# Altium project OpticalSensor.PrjPcb
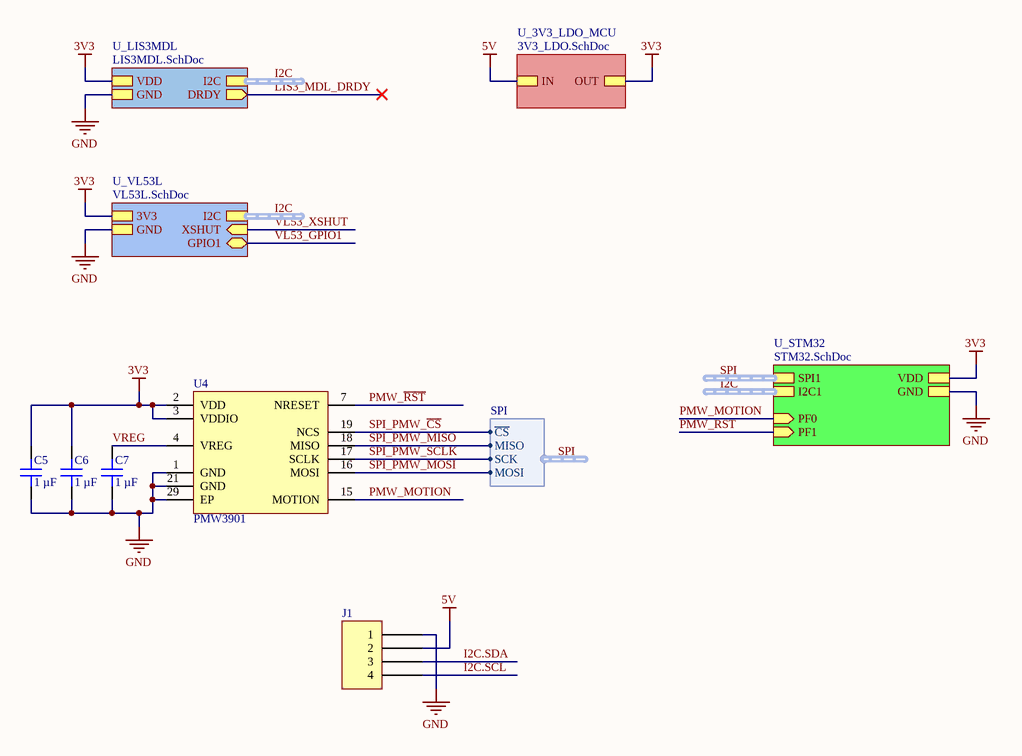
[diagram p0: OpticalSensor.SchDoc]
3 sheets, 19 parts. Net scope: hierarchical (ports join the sheet entries above them; power ports are global).
Board file: OpticalSensor.PcbDoc
Sheets:
  OpticalSensor.SchDoc
    U_3V3_LDO_MCU = 3V3_LDO.SchDoc
    U_STM32 = STM32.SchDoc

## Sheet OpticalSensor.SchDoc
size A; SheetNumber: 1; SheetTotal: 5

### Parts
C5  1 µF  [CAP 0402_1005]
C6  1 µF  [CAP 0402_1005]
C7  1 µF  [CAP 0402_1005]
J1  SM04B-SRSS-TB(LF)(SN)  [JST SM04B-SRSS-TB]  (value not drawn)
U4  PMW3901  [PMW3901]

### Sub-sheets
U_3V3_LDO_MCU = 3V3_LDO.SchDoc: OUT, IN
U_LIS3MDL = LIS3MDL.SchDoc (file not in this document): VDD, GND, I2C (harness I2C), DRDY (out)
U_STM32 = STM32.SchDoc: VDD, GND, SPI1 (harness SPI), I2C1 (harness I2C), PF0 (in), PF1 (in)
U_VL53L = VL53L.SchDoc (file not in this document): 3V3, GND, XSHUT (in), GPIO1 (bidir), I2C (harness I2C)

### Harnesses
SPI: MOSI, MISO, SCK, ~{CS}

### Nets
3V3: C5.2 C6.2 U4.2(VDD) U4.3(VDDIO) ; sheet U_3V3_LDO_MCU/OUT, sheet U_LIS3MDL/VDD, sheet U_STM32/VDD, sheet U_VL53L/3V3
5V: J1.2 ; sheet U_3V3_LDO_MCU/IN
GND: C5.1 C6.1 C7.1 J1.1 U4.1(GND) U4.21(GND) U4.29(EP) ; sheet U_LIS3MDL/GND, sheet U_STM32/GND, sheet U_VL53L/GND
I2C.SCL: J1.4
I2C.SDA: J1.3
LIS3_MDL_DRDY: sheet U_LIS3MDL/DRDY
PMW_MOTION: U4.15(MOTION) ; sheet U_STM32/PF0
PMW_~{RST}: U4.7(NRESET) ; sheet U_STM32/PF1
SPI_PMW_~{CS}: U4.19(NCS) ; sheet U_STM32/SPI1.~{CS}  [project net SPI.~{CS}]
SPI_PMW_MISO: U4.18(MISO) ; sheet U_STM32/SPI1.MISO  [project net SPI.MISO]
SPI_PMW_MOSI: U4.16(MOSI) ; sheet U_STM32/SPI1.MOSI  [project net SPI.MOSI]
SPI_PMW_SCLK: U4.17(SCLK) ; sheet U_STM32/SPI1.SCK  [project net SPI.SCK]
VL53_GPIO1: sheet U_VL53L/GPIO1
VL53_XSHUT: sheet U_VL53L/XSHUT
VREG: C7.2 U4.4(VREG)

### Buses and harness runs
harness I2C = sheet U_LIS3MDL/I2C
harness I2C = sheet U_STM32/I2C1
harness I2C = sheet U_VL53L/I2C
harness SPI = sheet U_STM32/SPI1

### Library data of the parts
C5-C7 = C0402C104K4RACAUTO: CAP CER 0.1UF 16V X7R 0402; manufacturer: KEMET; Capacitance: 0.1 µF; Tolerance: ±10%; Part Number: C0402C104K4RACAUTO; Value: 1 µF; Applications: Automotive, Bypass, Decoupling; componentlink1description: Datasheet; componentlink1url: https://api.kemet.com/component-edge/download/specsheet/C0402C104K4RACAUTO.pdf; componentlink2description: DigiKey Link; componentlink2url: https://www.digikey.com/en/products/detail/kemet/C0402C104K4RACAUTO/3314827; Device Package: 0402 (1005 Metric); lastupdated: 8/14/2022 9:05:51 PM; Lifecycle Status: Active; Minimum Order: 1; Mounting Type: Surface Mount, MLCC; Operating Temperature: -55°C ~ 125°C; Package / Case: 0402 (1005 Metric); packaging: TapeAndReel; partid: 3024; Part Status: Active; price: 0.01; Ratings: AEC-Q200; series: SMD Auto X7R; Size / Dimension: 0.039" L x 0.020" W (1.00mm x 0.50mm); Supplier 1: DigiKey; Supplier Part Number 1: 399-6828-1-ND; Temperature Coefficient: X7R; Thickness (Max): 0.022" (0.55mm); Voltage - Rated: 16V
J1 = SM04B-SRSS-TB(LF)(SN): CONN HEADER SMD R/A 4POS 1MM; Manufacturer: JST Sales America Inc.; Current Rating (Amps): 0.7A; Material Flammability Rating: UL94 V-0; Number of Positions: 4; Number of Positions Loaded: All; Pitch - Mating: 0.039" (1.00mm); Shrouding: Shrouded - 4 Wall; Style: Board to Cable/Wire; Voltage Rating: 50V; Part Number: SM04B-SRSS-TB(LF)(SN); ComponentLink1Description: Datasheet; ComponentLink1URL: http://www.jst-mfg.com/product/pdf/eng/eSH.pdf; ComponentLink2Description: DigiKey Link; ComponentLink2URL: http://digikey.com/product-detail/en/jst-sales-america-inc/SM04B-SRSS-TB-LF-SN/455-1804-1-ND/926875; Connector Type: Header; Contact Finish - Mating: Tin; Contact Finish - Post: Tin; Contact Material: Copper Alloy; Contact Shape: Square; Contact Type: Male Pin; Fastening Type: Push-Pull; Features: Solder Retention; Insulation Color: Natural; Insulation Height: 0.114" (2.90mm); Insulation Material: Polyamide (PA), Nylon; LastUpdated: 1/12/2020 11:41:52 PM; Lifecycle Status: Active; Minimum Order: 1; Mounting Type: Surface Mount, Right Angle; Number of Rows: 1; Operating Temperature: -25°C ~ 85°C; Packaging: TapeAndReel; PartId: 62; Part Status: Active; Price: 0.26; Series: SR; Supplier 1: DigiKey; Supplier Part Number 1: 455-1804-1-ND; Termination: Solder
U4 = PMW3901: PMW3901. Optical Flow Sensor

## Sheet 3V3_LDO.SchDoc
size A; SheetNumber: 2; SheetTotal: 5
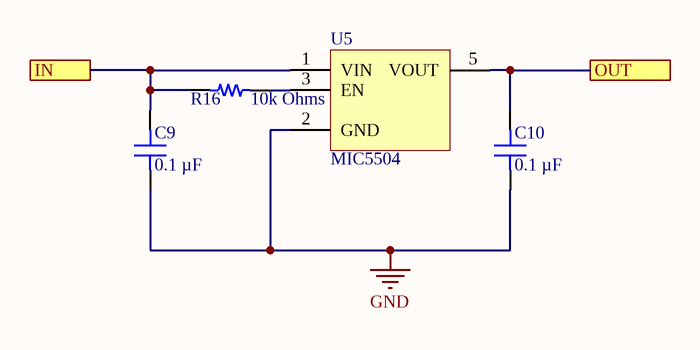
[diagram p1: 3V3_LDO.SchDoc]

### Parts
C9  0.1 µF  [CAP 0402_1005]
C10  0.1 µF  [CAP 0402_1005]
R16  10k Ohms  [RES 0402_1005]
U5  MIC5504  [TI SOT-23-5 DBV]

### Ports
IN, OUT

### Nets
3V3: C10.2 U5.5(VOUT) ; port OUT
5V: C9.2 R16.2 U5.1(VIN) ; port IN
GND: C9.1 C10.1 U5.2(GND)
NetR16_1: R16.1 U5.3(EN)

### Library data of the parts
C9 C10 = C0402C104K4RACAUTO: CAP CER 0.1UF 16V X7R 0402; manufacturer: KEMET; Tolerance: ±10%; Part Number: C0402C104K4RACAUTO; Value: 0.1 µF; Applications: Automotive, Bypass, Decoupling; Capacitance: 0.1 µF; componentlink1description: Datasheet; componentlink1url: https://api.kemet.com/component-edge/download/specsheet/C0402C104K4RACAUTO.pdf; componentlink2description: DigiKey Link; componentlink2url: https://www.digikey.com/en/products/detail/kemet/C0402C104K4RACAUTO/3314827; Device Package: 0402 (1005 Metric); lastupdated: 8/14/2022 9:05:51 PM; Lifecycle Status: Active; Minimum Order: 1; Mounting Type: Surface Mount, MLCC; Operating Temperature: -55°C ~ 125°C; Package / Case: 0402 (1005 Metric); packaging: TapeAndReel; partid: 3024; Part Status: Active; price: 0.01; Ratings: AEC-Q200; series: SMD Auto X7R; Size / Dimension: 0.039" L x 0.020" W (1.00mm x 0.50mm); Supplier 1: DigiKey; Supplier Part Number 1: 399-6828-1-ND; Temperature Coefficient: X7R; Thickness (Max): 0.022" (0.55mm); Voltage - Rated: 16V
R16 = CRCW0402330RJNEDC: RES 330 OHM 5% 1/16W 0402; Manufacturer: Vishay Dale; Power (Watts): 0.063W, 1/16W; Resistance: 330 Ohms; Temperature Coefficient: ±200ppm/°C; Part Number: CRCW0402330RJNEDC; Value: 10k Ohms; ComponentLink1Description: Datasheet; ComponentLink1URL: http://www.vishay.com/docs/28773/crcwce3.pdf; ComponentLink2Description: DigiKey Link; ComponentLink2URL: https://www.digikey.com/en/products/detail/vishay-dale/CRCW0402330RJNEDC/7928545; Composition: Thick Film; Device Package: 0402 (1005 Metric); Height - Seated (Max): 0.014" (0.35mm); LastUpdated: 8/14/2022 9:23:31 PM; Lifecycle Status: Active; Minimum Order: 1; Number of Terminations: 2; Operating Temperature: -55°C ~ 155°C; Package / Case: 0402 (1005 Metric); Packaging: CutTape; PartId: 15989; Part Status: Active; Price: 0.01; Series: CRCW-C; Size / Dimension: 0.039" L x 0.020" W (1.00mm x 0.50mm); Supplier 1: DigiKey; Supplier Part Number 1: 541-4123-1-ND; Supplier Device Package: 0402; Tolerance: ±5%
U5 = MIC5504-3.3YM5: 3.3V LDO

## Sheet STM32.SchDoc
size A; SheetNumber: 4; SheetTotal: 5
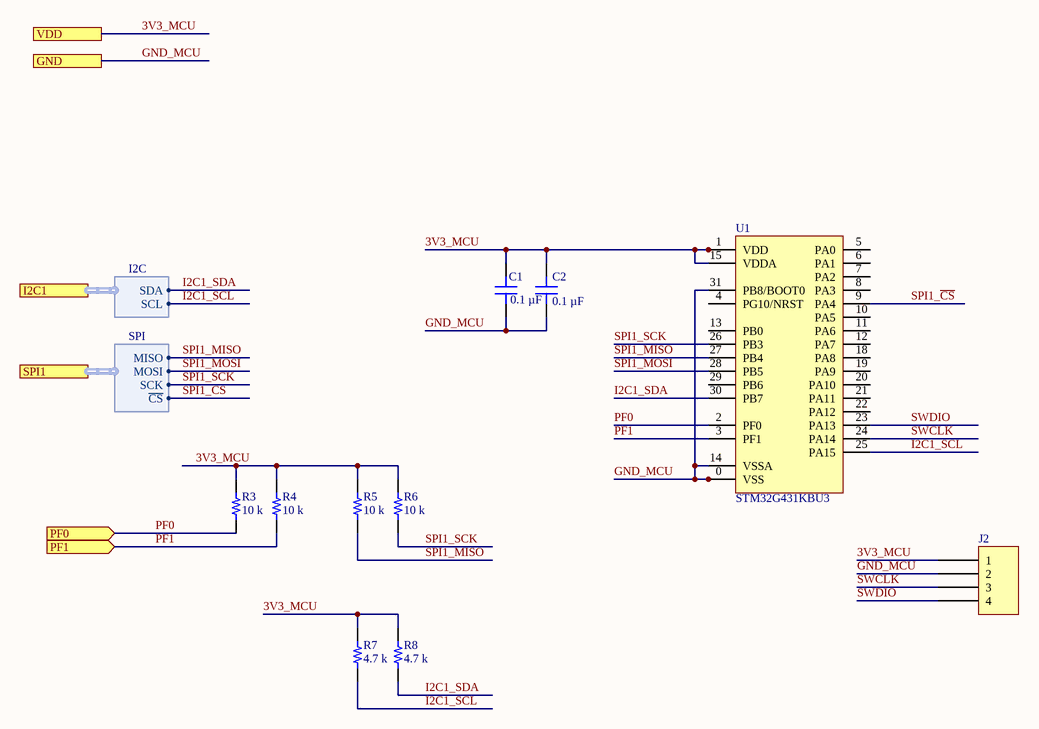
[diagram p2: STM32.SchDoc]

### Parts
C1  0.1 µF  [CAP 0402_1005]
C2  0.1 µF  [CAP 0402_1005]
J2  SM04B-SRSS-TB(LF)(SN)  [JST SM04B-SRSS-TB]  (value not drawn)
R3  10 k  [RES 0402_1005]
R4  10 k  [RES 0402_1005]
R5  10 k  [RES 0402_1005]
R6  10 k  [RES 0402_1005]
R7  4.7 k  [RES 0402_1005]
R8  4.7 k  [RES 0402_1005]
U1  STM32G431KBU3  [QFN50P400X400X60-32N]

### Ports
GND, I2C1 (harness I2C), PF0 (in), PF1 (in), SPI1 (harness SPI), VDD

### Harnesses
I2C: SCL, SDA
SPI: MOSI, MISO, SCK, ~{CS}

### Nets
3V3_MCU: C1.2 C2.2 J2.1 R3.2 R4.2 R5.2 R6.2 R7.2 R8.2 U1.1(VDD) U1.15(VDDA) U1.17(VDD) ; port VDD  [project net 3V3]
GND_MCU: C1.1 C2.1 J2.2 U1.0(VSS) U1.14(VSSA) U1.16(VSS) U1.31(PB8/BOOT0) U1.32(VSS) ; port GND  [project net GND]
I2C1_SCL: R7.1 U1.25(PA15) ; port I2C1.SCL  [project net I2C.SCL]
I2C1_SDA: R8.1 U1.30(PB7) ; port I2C1.SDA  [project net I2C.SDA]
PF0: R3.1 U1.2(PF0) ; port PF0  [project net PMW_MOTION]
PF1: R4.1 U1.3(PF1) ; port PF1  [project net PMW_~{RST}]
SPI1_~{CS}: U1.9(PA4) ; port SPI1.~{CS}  [project net SPI.~{CS}]
SPI1_MISO: R5.1 U1.27(PB4) ; port SPI1.MISO  [project net SPI.MISO]
SPI1_MOSI: U1.28(PB5) ; port SPI1.MOSI  [project net SPI.MOSI]
SPI1_SCK: R6.1 U1.26(PB3) ; port SPI1.SCK  [project net SPI.SCK]
SWCLK: J2.3 U1.24(PA14)
SWDIO: J2.4 U1.23(PA13)

Not connected (* = marked no-connect by the designer): U1 4(PG10/NRST) 5(PA0) 6(PA1) 7(PA2) 8(PA3) 10(PA5) 11(PA6) 12(PA7) 13(PB0) 18(PA8) 19(PA9) 20(PA10) 21(PA11) 22(PA12) 29(PB6)

### Library data of the parts
C1 C2 = C0402C104K4RACAUTO: as C9 on sheet 3V3_LDO; Part Number: C0402C104K4RACAUTO; Value: 0.1 µF; Applications: Automotive, Bypass, Decoupling; Capacitance: 0.1 µF; componentlink1description: Datasheet; componentlink1url: https://api.kemet.com/component-edge/download/specsheet/C0402C104K4RACAUTO.pdf; componentlink2description: DigiKey Link; componentlink2url: https://www.digikey.com/en/products/detail/kemet/C0402C104K4RACAUTO/3314827; Device Package: 0402 (1005 Metric); lastupdated: 8/14/2022 9:05:51 PM; Lifecycle Status: Active; Minimum Order: 1; Mounting Type: Surface Mount, MLCC; Operating Temperature: -55°C ~ 125°C; Package / Case: 0402 (1005 Metric); packaging: TapeAndReel; partid: 3024; Part Status: Active; price: 0.01; Ratings: AEC-Q200; series: SMD Auto X7R; Size / Dimension: 0.039" L x 0.020" W (1.00mm x 0.50mm); Supplier 1: DigiKey; Supplier Part Number 1: 399-6828-1-ND; Temperature Coefficient: X7R; Thickness (Max): 0.022" (0.55mm); Voltage - Rated: 16V
J2 = SM04B-SRSS-TB(LF)(SN): as J1 on sheet OpticalSensor; Part Number: SM04B-SRSS-TB(LF)(SN); ComponentLink1Description: Datasheet; ComponentLink1URL: http://www.jst-mfg.com/product/pdf/eng/eSH.pdf; ComponentLink2Description: DigiKey Link; ComponentLink2URL: http://digikey.com/product-detail/en/jst-sales-america-inc/SM04B-SRSS-TB-LF-SN/455-1804-1-ND/926875; Connector Type: Header; Contact Finish - Mating: Tin; Contact Finish - Post: Tin; Contact Material: Copper Alloy; Contact Shape: Square; Contact Type: Male Pin; Fastening Type: Push-Pull; Features: Solder Retention; Insulation Color: Natural; Insulation Height: 0.114" (2.90mm); Insulation Material: Polyamide (PA), Nylon; LastUpdated: 1/12/2020 11:41:52 PM; Lifecycle Status: Active; Minimum Order: 1; Mounting Type: Surface Mount, Right Angle; Number of Rows: 1; Operating Temperature: -25°C ~ 85°C; Packaging: TapeAndReel; PartId: 62; Part Status: Active; Price: 0.26; Series: SR; Supplier 1: DigiKey; Supplier Part Number 1: 455-1804-1-ND; Termination: Solder
R3-R8 = RT0402DRE0710KL: RES SMD 10K OHM 0.5% 1/16W 0402; Manufacturer: Yageo; Power (Watts): 0.063W, 1/16W; Temperature Coefficient: ±50ppm/°C; Part Number: RT0402DRE0710KL; ComponentLink1Description: Datasheet; ComponentLink1URL: https://www.yageo.com/upload/media/product/productsearch/datasheet/rchip/PYu-RT_1-to-0.01_RoHS_L_11.pdf; ComponentLink2Description: DigiKey Link; ComponentLink2URL: https://www.digikey.com/en/products/detail/yageo/RT0402DRE0710KL/1071269; Composition: Thin Film; Device Package: 0402 (1005 Metric); Height - Seated (Max): 0.014" (0.35mm); LastUpdated: 2/9/2024 8:29:56 PM; Lifecycle Status: Active; Minimum Order: 1; Number of Terminations: 2; Operating Temperature: -55°C ~ 155°C; Package / Case: 0402 (1005 Metric); Packaging: TapeAndReel; PartId: 9812; Part Status: Active; Price: 0.02; Resistance: 10 k; Series: RT; Size / Dimension: 0.039" L x 0.020" W (1.00mm x 0.50mm); Supplier 1: DigiKey; Supplier Part Number 1: 311-2217-1-ND; Supplier Device Package: 0402; Tolerance: ±0.5%
  R3-R6: Value: 10 k
  R7 R8: Value: 4.7 k
U1 = STM32G431KBU3: MCU UFQFPN-32

## Nets that join several sheets
3V3: OpticalSensor (C5.2 C6.2 U4.2 U4.3), 3V3_LDO (C10.2 U5.5), STM32 (12 pins)
5V: OpticalSensor (J1.2), 3V3_LDO (C9.2 R16.2 U5.1)
GND: OpticalSensor (7 pins), 3V3_LDO (C9.1 C10.1 U5.2), STM32 (8 pins)
PMW_MOTION: OpticalSensor (U4.15), STM32 (R3.1 U1.2)
PMW_~{RST}: OpticalSensor (U4.7), STM32 (R4.1 U1.3)
SPI.~{CS}: OpticalSensor (U4.19), STM32 (U1.9)
SPI.MISO: OpticalSensor (U4.18), STM32 (R5.1 U1.27)
SPI.MOSI: OpticalSensor (U4.16), STM32 (U1.28)
SPI.SCK: OpticalSensor (U4.17), STM32 (R6.1 U1.26)

## Assembly variants
Main: not fitted J2